# EAGLE schematic OffsetAmp (EAGLE 6.5.0)
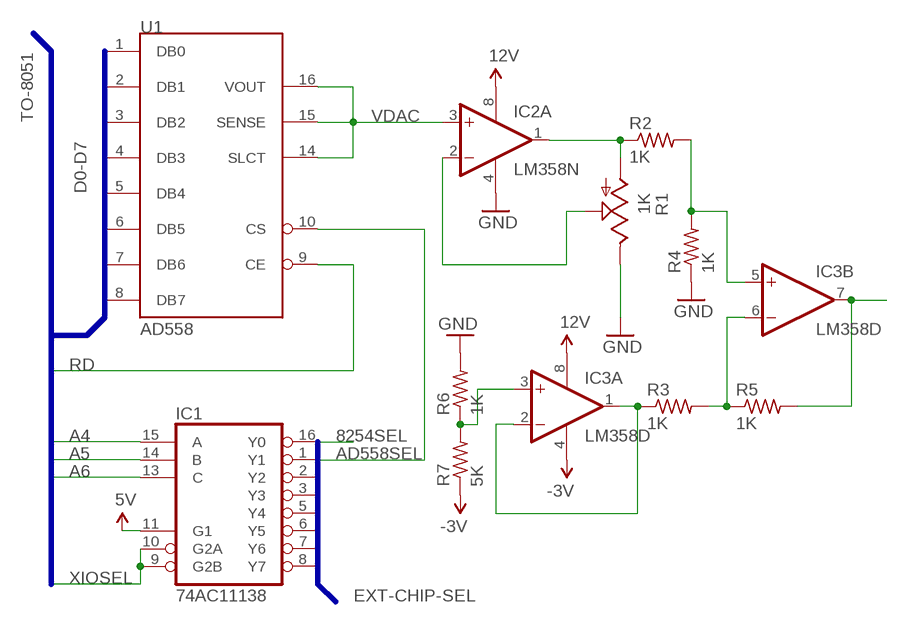
[diagram p0: schematic, sheet 1]

## Parts
IC1  74AC11138  [DIL16]
IC2  LM358N  [DIL08]
IC3  LM358D  [SO08]
R1  1K  TRIM_US-3223G  [3223G]
R2  1K  R-US_0204/2V  [0204V]
R3  1K  R-US_0204/2V  [0204V]
R4  1K  R-US_0204/2V  [0204V]
R5  1K  R-US_0204/2V  [0204V]
R6  1K  R-US_0204/2V  [0204V]
R7  5K  R-US_0204/2V  [0204V]
U1  AD558  [DIL16]

## Nets
5V: IC1.11(G1) IC2.8(P:V+) IC3.4(P:V-) IC3.8(P:V+) R7.1 ; supply symbol labelled 12V, -3V
8254SEL: IC1.16(Y0)
A4: IC1.15(A)
A5: IC1.14(B)
A6: IC1.13(C)
AD558SEL: IC1.1(Y1) U1.10(CS)
GND: IC2.4(P:V-) R1.3(E) R4.1 R6.2
N$1: IC2.1(A:OUT) R1.1(A) R2.1
N$2: IC2.2(A:-IN) R1.2(S)
N$3: IC3.1(A:OUT) IC3.2(A:-IN) R3.1
N$4: IC3.3(A:+IN) R6.1 R7.2
N$5: IC3.5(B:+IN) R2.2 R4.2
N$6: IC3.6(B:-IN) R3.2 R5.1
N$8: IC3.7(B:OUT) R5.2
RD: U1.9(CE)
VDAC: IC2.3(A:+IN) U1.14(SLCT) U1.15(SENSE) U1.16(VOUT)
XIOSEL: IC1.9(G2B) IC1.10(G2A)
Unconnected: IC1.2(Y2) IC1.3(Y3) IC1.5(Y4) IC1.6(Y5) IC1.7(Y6) IC1.8(Y7) IC2.5(B:+IN) IC2.6(B:-IN) IC2.7(B:OUT) U1.1(DB0) U1.2(DB1) U1.3(DB2) U1.4(DB3) U1.5(DB4) U1.6(DB5) U1.7(DB6) U1.8(DB7)

## Buses
D0-D7
EXT-CHIP-SEL
TO-8051

## Power pins joined to a net without a drawn wire
GND: IC1.4(GND) U1.12(GND)
GND2: U1.13(GND2)
VCC: IC1.12(VCC) U1.11(VCC)

## Library data of the parts
IC1 = 74ac-logic:74AC11138: 3 to 8 line DECODER/DEMULTIPLEXER
IC2 IC3 = linear:LM358: OP AMP also LM158; LM258; LM2904 Source: http://cache.national.com/ds/LM/LM158.pdf
R1 = pot:TRIM_US-: POTENTIOMETER
R2-R7 = resistor:R-US_: RESISTOR, American symbol
U1 = AD558:AD558: Voltage-output 8-bit digital-to-analog converter The AD558 DACPORT is a complete voltage-output 8-bit digital-to-analog converter, including output amplifier, full microprocessor interface and precision voltage reference on a single monolithic chip. No external components or trims are required to interface, with full accuracy, an 8-bit data bus to an analog system.